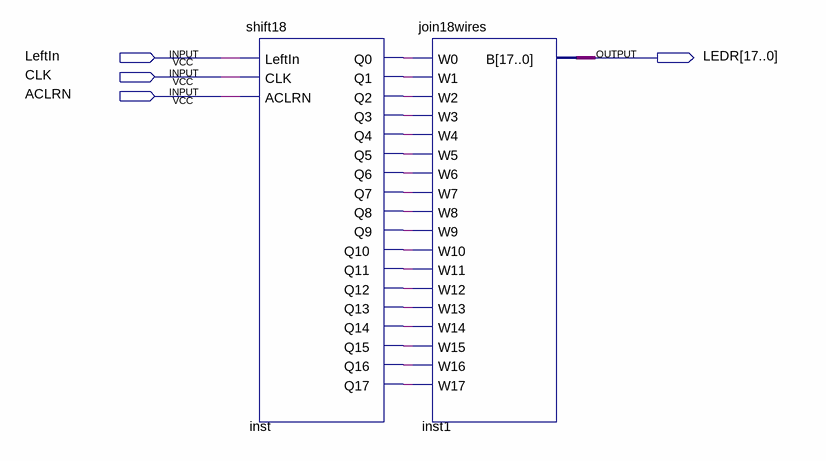
[diagram p0: schematic sheet]
// Quartus schematic posun18.bdf as structural Verilog: 2 symbols, 4 pins
module posun18 (
  input  LeftIn,
  input  CLK,
  input  ACLRN,
  output [17:0] LEDR
);

  wire inst_q0, inst_q1, inst_q2, inst_q3, inst_q4, inst_q5, inst_q6, inst_q7, inst_q8, inst_q9, inst_q10,
       inst_q11, inst_q12, inst_q13, inst_q14, inst_q15, inst_q16, inst_q17;

  shift18 inst (
    .LeftIn(LeftIn), .CLK(CLK), .ACLRN(ACLRN), .Q0(inst_q0), .Q1(inst_q1), .Q2(inst_q2), .Q3(inst_q3),
    .Q4(inst_q4), .Q5(inst_q5), .Q6(inst_q6), .Q7(inst_q7), .Q8(inst_q8), .Q9(inst_q9), .Q10(inst_q10),
    .Q11(inst_q11), .Q12(inst_q12), .Q13(inst_q13), .Q14(inst_q14), .Q15(inst_q15), .Q16(inst_q16),
    .Q17(inst_q17));
  join18wires inst1 (
    .W0(inst_q0), .W1(inst_q1), .W2(inst_q2), .W3(inst_q3), .W4(inst_q4), .W5(inst_q5), .W6(inst_q6),
    .W7(inst_q7), .W8(inst_q8), .W9(inst_q9), .W10(inst_q10), .W11(inst_q11), .W12(inst_q12), .W13(inst_q13),
    .W14(inst_q14), .W15(inst_q15), .W16(inst_q16), .W17(inst_q17), .B(LEDR));
endmodule
